# EAGLE design ADT7302 (EAGLE 6.5.0)
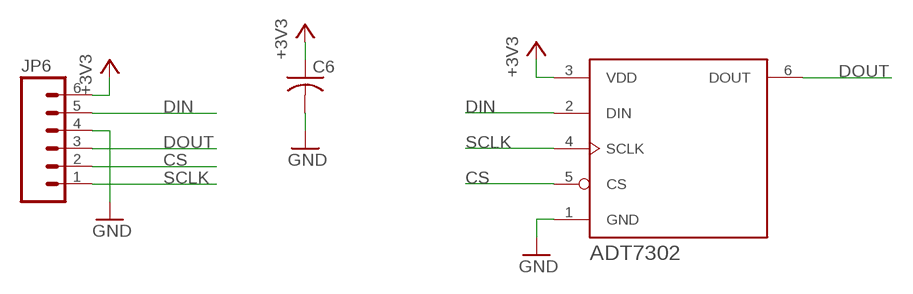
[diagram p0: schematic, sheet 1]

## Parts
C6  C-USC0805K  [C0805K]
JP6  M06LOCK  [1X06_LOCK]
U$2  ADT7302  [SOT23]

## Nets
+3V3: C6.1 JP6.6 U$2.3(VDD)
CS: JP6.2 U$2.5(CS)
DIN: JP6.5 U$2.2(DIN)
DOUT: JP6.3 U$2.6(DOUT)
GND: C6.2 JP6.4 U$2.1(GND)
SCLK: JP6.1 U$2.4(SCLK)

## Library data of the parts
C6 = rcl:C-US: CAPACITOR, American symbol
JP6 = SparkFun-Connectors:M06: Header 6 Standard 6-pin 0.1" header. Use with straight break away headers (SKU : PRT-00116), right angle break away headers (PRT-00553), swiss pins (PRT-00743), machine pins (PRT-00117), and female headers (PRT-00115). Molex polarized connector foot print use with SKU : PRT-08094 with associated crimp pins and housings. NOTES ON THE VARIANTS LOCK and LOCK_LONGPADS... This footprint was designed to help hold the alignment of a through-hole component (i.e. 6-pin header) while soldering it into place. You may notice that each hole has been shifted either up or down by 0.005 of an inch from it's more standard position (which is a perfectly straight line). This slight alteration caused the pins (the squares in the middle) to touch the edges of the holes. Because they are alternating, it causes a "brace" to hold the component in place. 0.005 has proven to be the perfect amount of "off-center" position when using our standard breakaway headers. Although looks a little odd when you look at the bare footprint, once you have a header in there, the alteration is very hard to notice. Also,if you push a header all the way into place, it is covered up entirely on the bottom side. This idea of altering the position of holes to aid alignment will be further integrated into the Sparkfun Library for other footprints. It can help hold any component with 3 or more connection pins.
U$2 = analog-devices:ADT7302

## Board
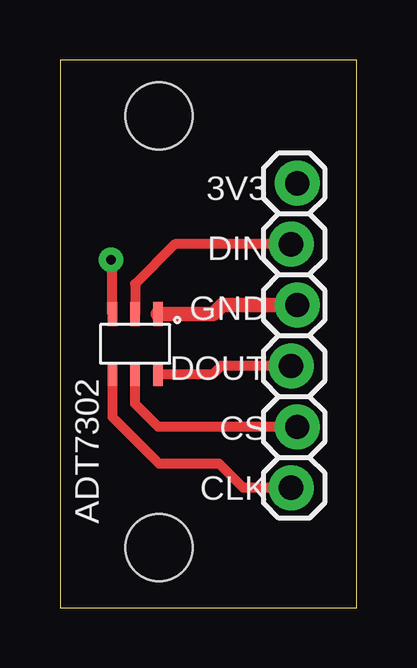
[diagram p1: board, top side]
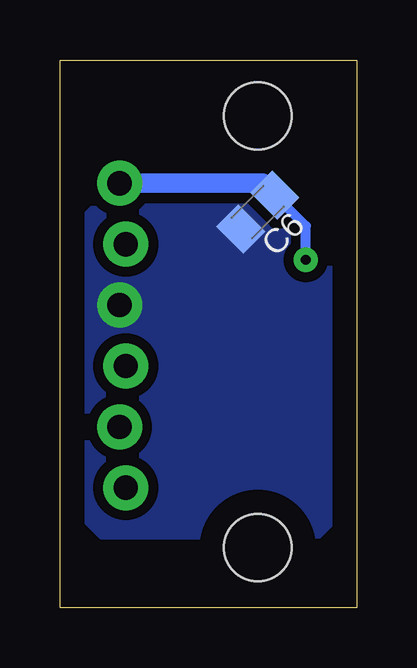
[diagram p2: board, bottom side, seen from below]

Size 12.37 x 22.84 mm. Coordinates in mm from the lower left corner, seen from the top.
Outline: 0,0 12.37,0 12.37,22.84 0,22.84 0,0
Copper layers (1*16): Top 0.035mm / dielectric 1.5mm / Bottom 0.035mm
Design rules "default": minimum track width 10mil, minimum drill 24mil, track to track 8mil, track to pad 8mil, pad to pad 8mil, via to via 8mil, smd to smd 8mil, copper to edge 40mil, drill to drill 8mil, minimum pad ring 10mil, minimum via ring 8mil, stop-mask expansion 4mil, vias tented up to drill 0mil, thermal gap 10mil
Holes 2.8 mm at 4.13,2.5 4.13,20.5

### Footprints (pad centres in the part's own frame; a part is rotated, then mirrored left to right if it is on the bottom)
C0805K = smd 1.3 x 1.6: 1 -1,0; 2 1,0
1X06_LOCK = drill 1.016 pad 1.88: 1 0,0; 2 2.54,-0.254; 3 5.08,0; 4 7.62,-0.254; 5 10.16,0; 6 12.7,-0.254
SOT23 = smd 0.4 x 1: 1 -0.95,-1.25; 2 0,-1.25; 3 0.95,-1.25; 4 0.95,1.25; 5 0,1.25; 6 -0.95,1.25

### Placement (x,y rotation side)
C6  4.13,16.5 225 bottom
JP6  9.63,5 90 top
U$2  3.13,11 180 top

### Tracks (layer width: path | path; a pad name or v marks a point on that pad's centre or on a via)
+3V3  (via drill 0.4 pad 1.02)
  Top 0.406: U$2.3 2.18,14.45 v2.13,14.5
  Bottom 0.406: v2.13,14.5 2.13,15.91 C6.1
  Bottom 0.813: JP6.6 3.92,17.7 C6.1
CS
  Top 0.406: JP6.2 4.09,7.54 3.13,8.5 U$2.5
DIN
  Top 0.406: JP6.5 4.79,15.16 3.13,13.5 U$2.2
DOUT
  Top 0.406: U$2.6 6.38,9.75 6.71,10.08 JP6.3
GND
  Top 0.61: U$2.1 6.38,12.25 6.75,12.62 JP6.4
  pour Bottom (isolate 0.406, no thermals): 10.63,17 1.63,17 0.63,16 0.63,4 1.63,3 10.63,3 11.63,4 11.63,16
SCLK
  Top 0.406: JP6.1 7.63,5 6.63,6 4.13,6 2.18,7.95 U$2.4

### Text on the board
tPlace: 3V3 | DIN | GND | DOUT | CS | CLK | ADT7302